# EasyEDA schematic 1-Schematic_trashthingie.json
TITLE: Trash frog; REV: 1.0; Date: 2024-06-26; Sheet: 1/1; Drawn By: wangjul001; Company: ButterToastCorp
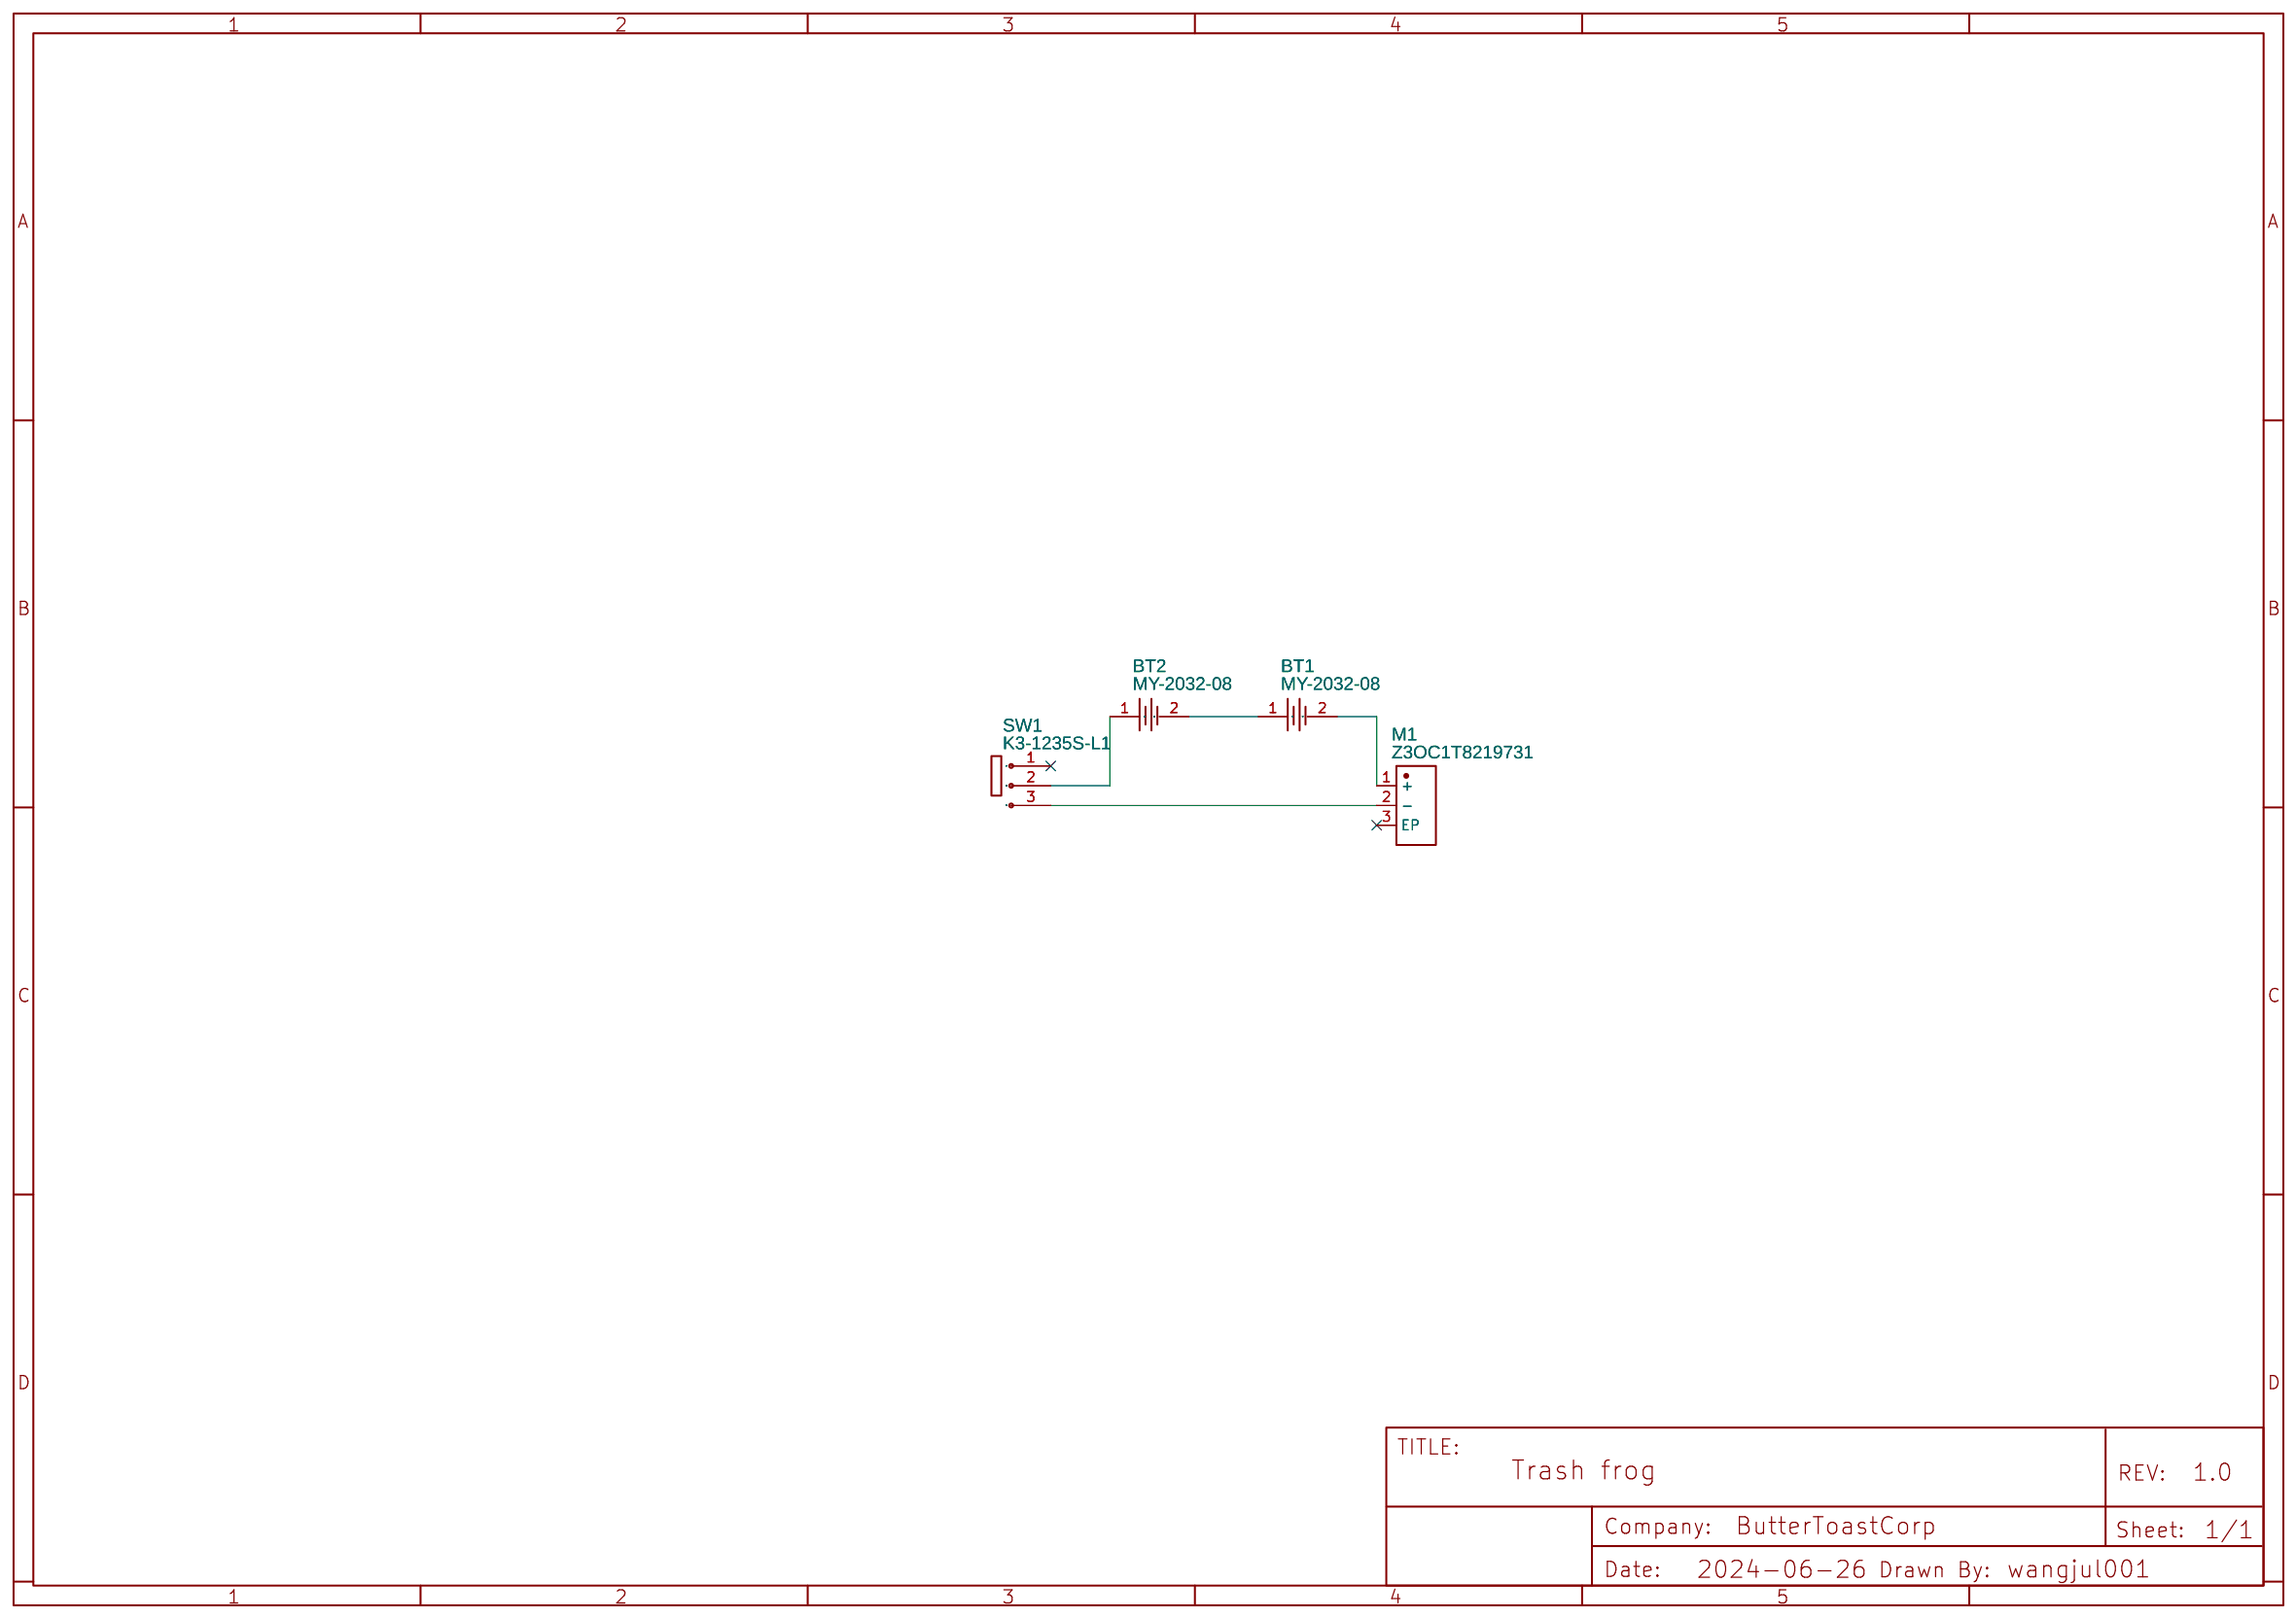
[diagram p0: schematic sheet]

## Parts
BT1  MY-2032-08  [BAT-SMD_MY-2032-08]
BT2  MY-2032-08  [BAT-SMD_MY-2032-08]
M1  Z3OC1T8219731  [VIBRATING-MOTOR-SMD_3P-C9900001680]
SW1  K3-1235S-L1  [SW-TH_K3-1235S-L1]

## Library data of the parts
BT1 BT2 = MY-2032-08: Contributor: LCSC; Supplier: LCSC; Supplier Part: C964831; Manufacturer: MYOUNG(美阳); JLCPCB Part Class: Extended Part
M1 = Z3OC1T8219731: Contributor: LCSC; Supplier: LCSC; Supplier Part: C2894731; Manufacturer: KOTL(金龙机电); JLCPCB Part Class: Extended Part
SW1 = K3-1235S-L1: Contributor: LCSC; Supplier: LCSC; Supplier Part: C223838; Manufacturer: 韩国韩荣; JLCPCB Part Class: Extended Part

## Nets
Net-(BT1-1): BT1.1 BT2.2
Net-(BT1-2): BT1.2 M1.1(+)
Net-(BT2-1): BT2.1 SW1.2
Net-(M1-2): M1.2(-) SW1.3

Not connected (* = marked no-connect by the designer): M1 3(EP)*; SW1 1*
